# Altium project Power_Monitor.PrjPcb
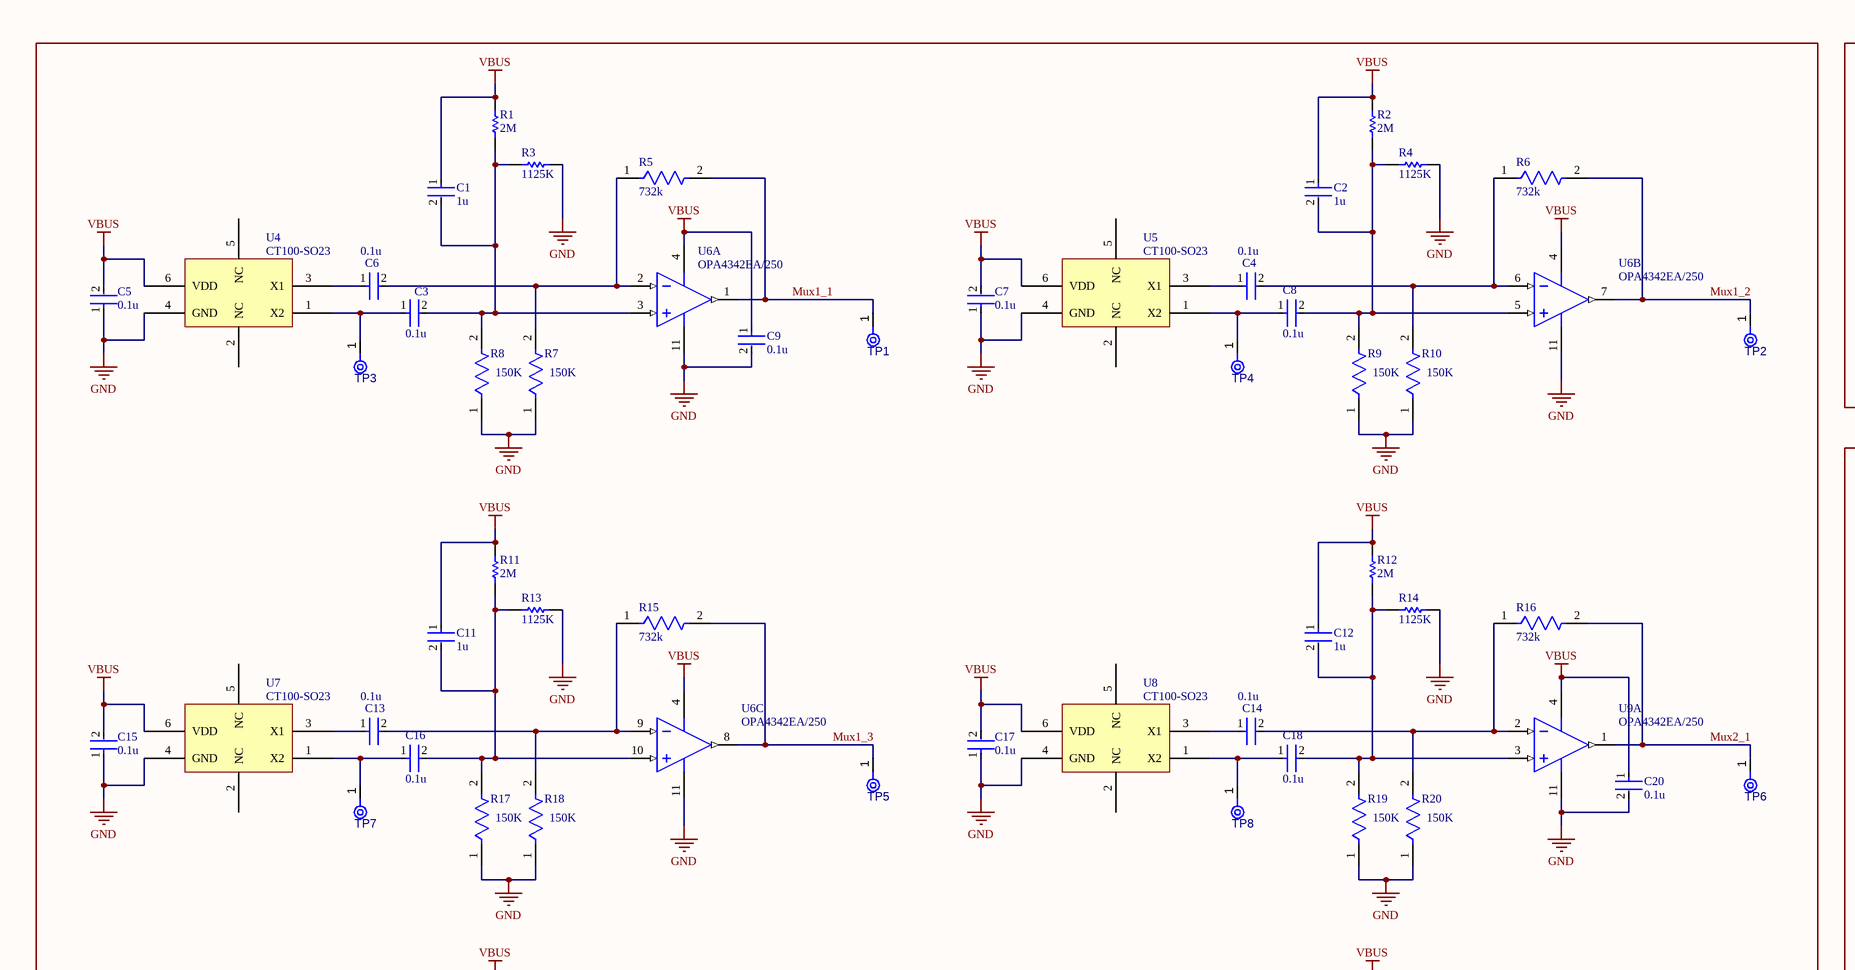
[diagram p0: 3PhaseMeter.SchDoc, top left]
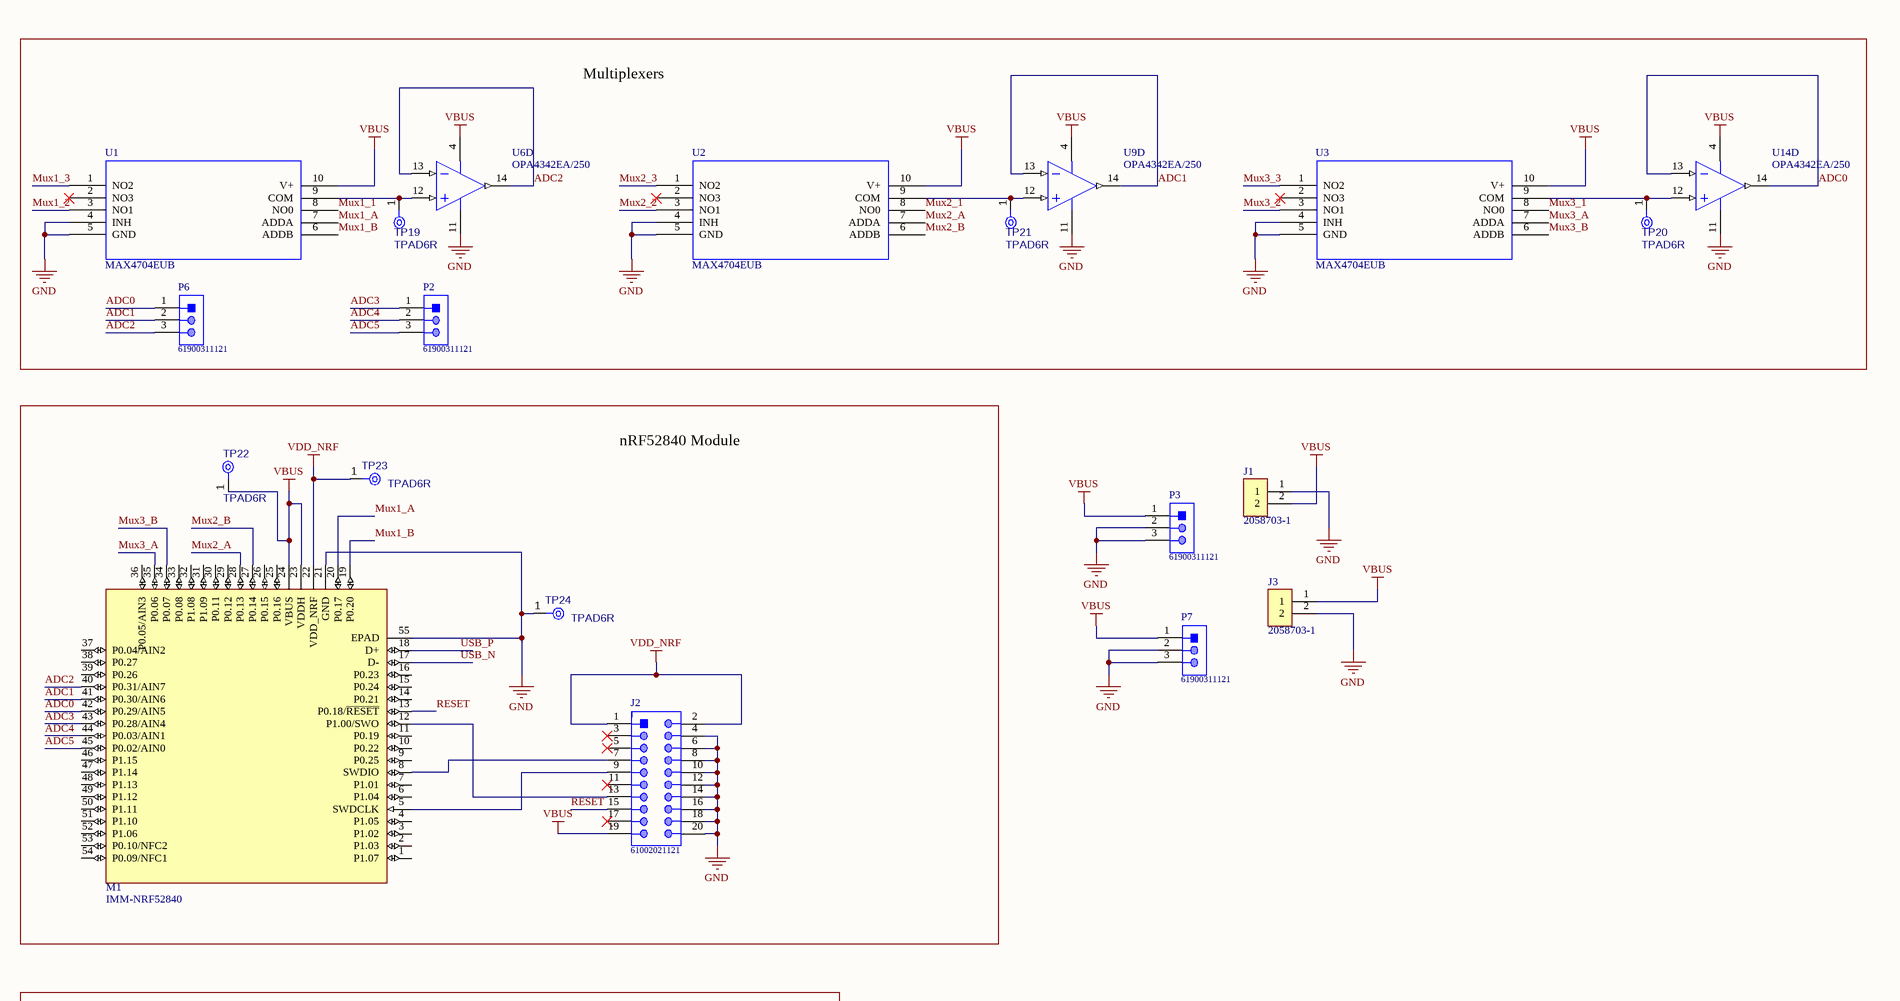
[diagram p1: 3PhaseMeter.SchDoc, top right]
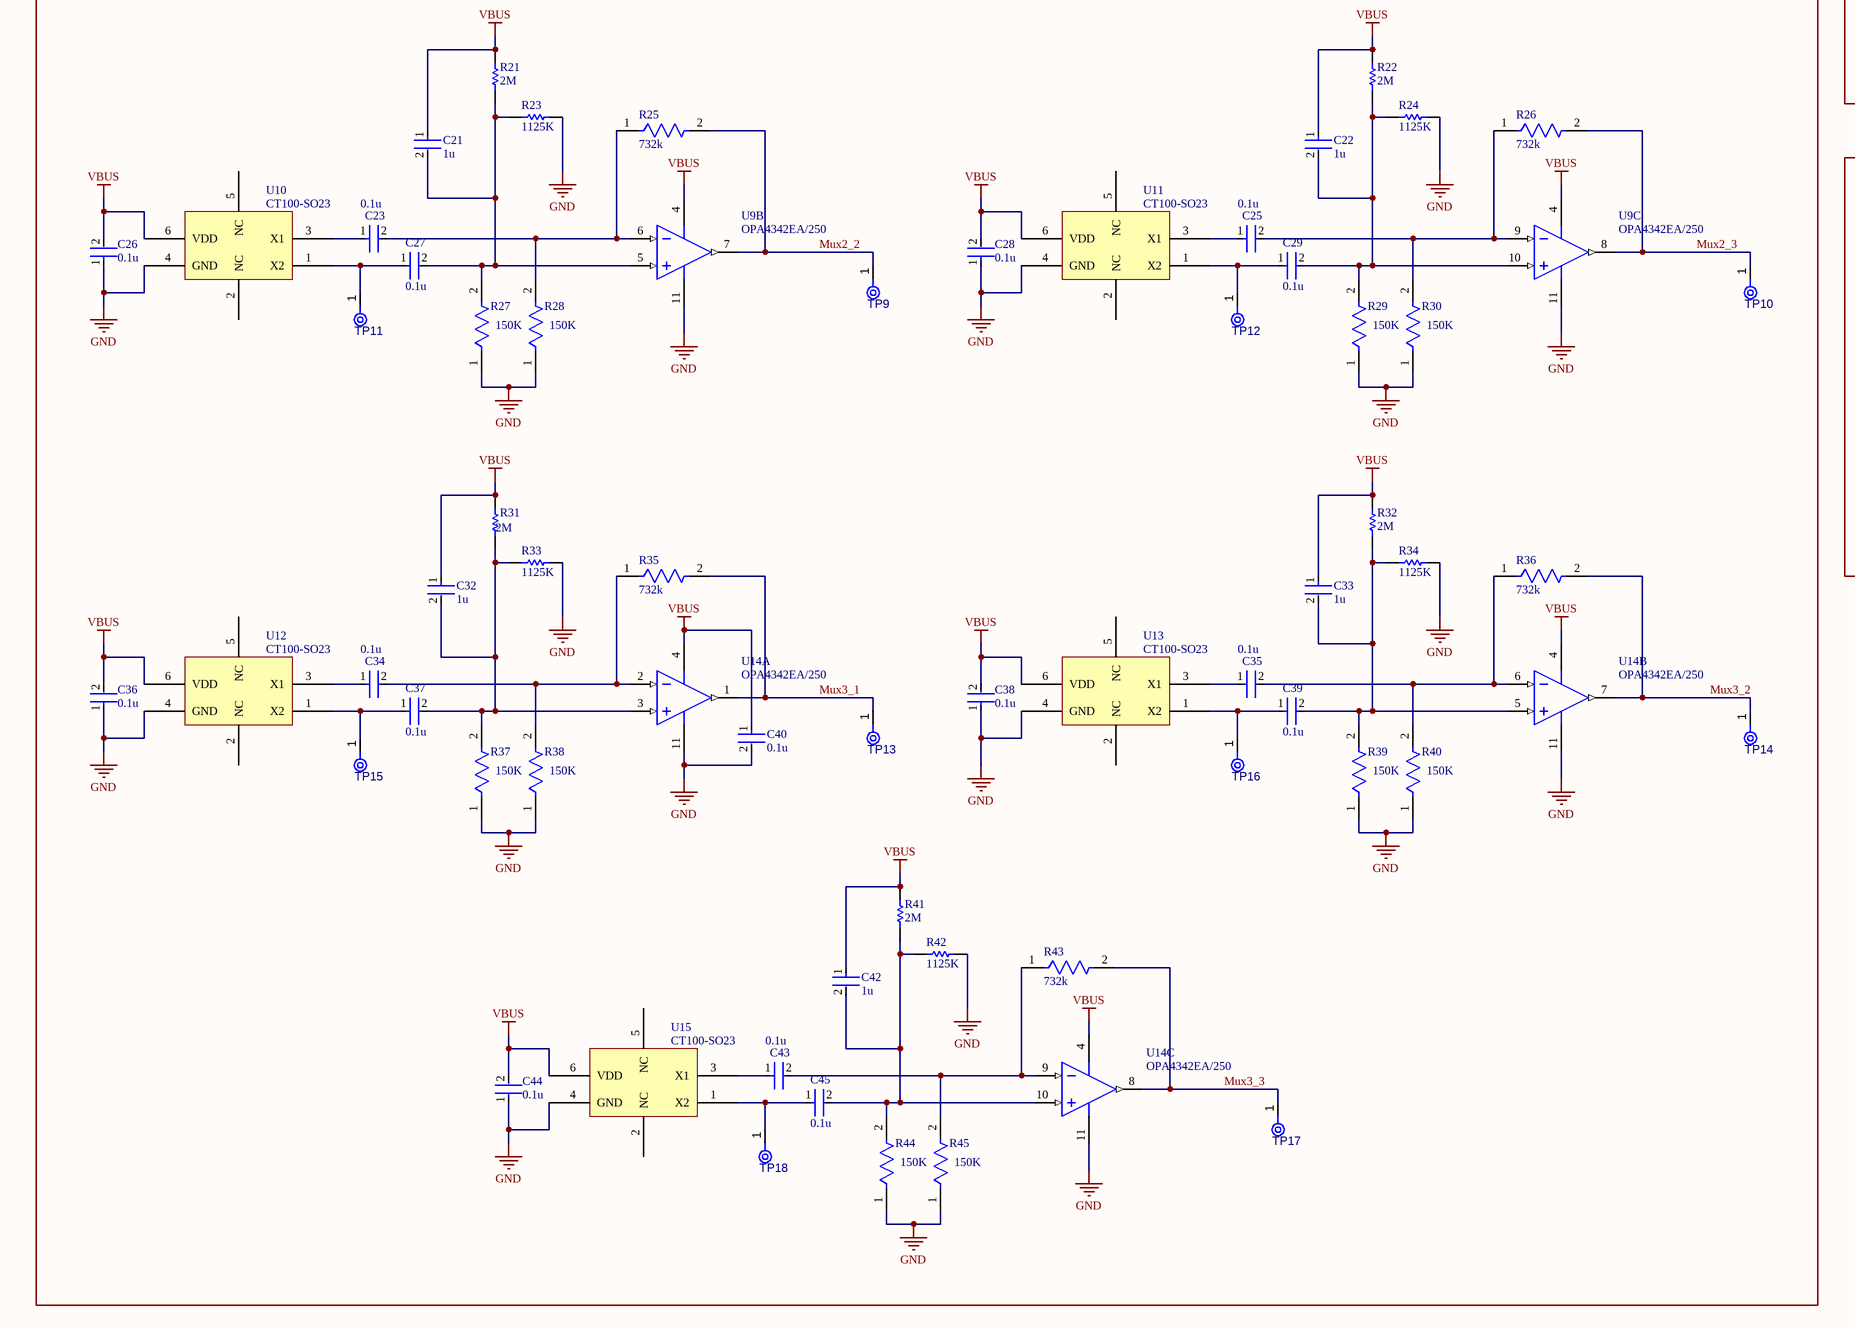
[diagram p2: 3PhaseMeter.SchDoc, bottom left]
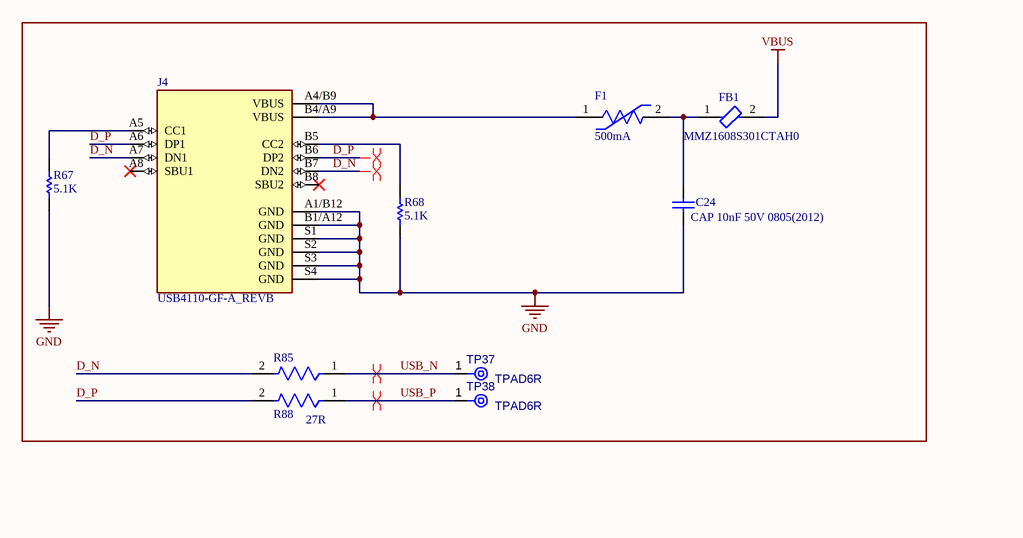
[diagram p3: 3PhaseMeter.SchDoc, bottom right]
1 sheet, 141 parts. Net scope: global (net labels, ports and power ports of the same name join across sheets).
Board file: 3PhaseMeter.PcbDoc

## Sheet 3PhaseMeter.SchDoc
size A1; SheetNumber: 1; SheetTotal: 1

### Parts
C1  1u  [FP-C3216-160-0_2-IPC_C]
C2  1u  [FP-C3216-160-0_2-IPC_C]
C3  0.1u  [FP-C0805C-DN-MFG]
C4  0.1u  [FP-C0805C-DN-MFG]
C5  0.1u  [FP-C0805C-DN-MFG]
C6  0.1u  [FP-C0805C-DN-MFG]
C7  0.1u  [FP-C0805C-DN-MFG]
C8  0.1u  [FP-C0805C-DN-MFG]
C9  0.1u  [FP-1206-L_3_2_0_2-W_1_6_0-IPC_A]
C11  1u  [FP-C3216-160-0_2-IPC_C]
C12  1u  [FP-C3216-160-0_2-IPC_C]
C13  0.1u  [FP-C0805C-DN-MFG]
C14  0.1u  [FP-C0805C-DN-MFG]
C15  0.1u  [FP-C0805C-DN-MFG]
C16  0.1u  [FP-C0805C-DN-MFG]
C17  0.1u  [FP-C0805C-DN-MFG]
C18  0.1u  [FP-C0805C-DN-MFG]
C20  0.1u  [FP-1206-L_3_2_0_2-W_1_6_0-IPC_A]
C21  1u  [FP-C3216-160-0_2-IPC_C]
C22  1u  [FP-C3216-160-0_2-IPC_C]
C23  0.1u  [FP-C0805C-DN-MFG]
C24  CAP 10nF 50V 0805(2012)  [CAPC0805(2012)75_N]
C25  0.1u  [FP-C0805C-DN-MFG]
C26  0.1u  [FP-C0805C-DN-MFG]
C27  0.1u  [FP-C0805C-DN-MFG]
C28  0.1u  [FP-C0805C-DN-MFG]
C29  0.1u  [FP-C0805C-DN-MFG]
C32  1u  [FP-C3216-160-0_2-IPC_C]
C33  1u  [FP-C3216-160-0_2-IPC_C]
C34  0.1u  [FP-C0805C-DN-MFG]
C35  0.1u  [FP-C0805C-DN-MFG]
C36  0.1u  [FP-C0805C-DN-MFG]
C37  0.1u  [FP-C0805C-DN-MFG]
C38  0.1u  [FP-C0805C-DN-MFG]
C39  0.1u  [FP-C0805C-DN-MFG]
C40  0.1u  [FP-1206-L_3_2_0_2-W_1_6_0-IPC_A]
C42  1u  [FP-C3216-160-0_2-IPC_C]
C43  0.1u  [FP-C0805C-DN-MFG]
C44  0.1u  [FP-C0805C-DN-MFG]
C45  0.1u  [FP-C0805C-DN-MFG]
F1  500mA  [FP-1206L050YR-MFG]
FB1  MMZ1608S301CTAH0  [FP-MMZ1608-0_6-IPC_C]
J1  2058703-1  [TE_2058703-1]
J2  61002021121  [61002021121]
J3  2058703-1  [TE_2058703-1]
J4  USB4110-GF-A_REVB  [GCT_USB4110-GF-A_REVB]
M1  IMM-NRF52840  [IMM-NRF52840]
P2  61900311121  [61900311121]
P3  61900311121  [61900311121]
P6  61900311121  [61900311121]
P7  61900311121  [61900311121]
R1  2M  [RESC2013X60X40LL20T25]
R2  2M  [RESC2013X60X40LL20T25]
R3  1125K  [RESC2013X60X35ML10T20]
R4  1125K  [RESC2013X60X35ML10T20]
R5  732k  [FP-AC0805-MFG]
R6  732k  [FP-AC0805-MFG]
R7  150K  [FP-CRCW0805-e3-MFG]
R8  150K  [FP-CRCW0805-e3-MFG]
R9  150K  [FP-CRCW0805-e3-MFG]
R10  150K  [FP-CRCW0805-e3-MFG]
R11  2M  [RESC2013X60X40LL20T25]
R12  2M  [RESC2013X60X40LL20T25]
R13  1125K  [RESC2013X60X35ML10T20]
R14  1125K  [RESC2013X60X35ML10T20]
R15  732k  [FP-AC0805-MFG]
R16  732k  [FP-AC0805-MFG]
R17  150K  [FP-CRCW0805-e3-MFG]
R18  150K  [FP-CRCW0805-e3-MFG]
R19  150K  [FP-CRCW0805-e3-MFG]
R20  150K  [FP-CRCW0805-e3-MFG]
R21  2M  [RESC2013X60X40LL20T25]
R22  2M  [RESC2013X60X40LL20T25]
R23  1125K  [RESC2013X60X35ML10T20]
R24  1125K  [RESC2013X60X35ML10T20]
R25  732k  [FP-AC0805-MFG]
R26  732k  [FP-AC0805-MFG]
R27  150K  [FP-CRCW0805-e3-MFG]
R28  150K  [FP-CRCW0805-e3-MFG]
R29  150K  [FP-CRCW0805-e3-MFG]
R30  150K  [FP-CRCW0805-e3-MFG]
R31  2M  [RESC2013X60X40LL20T25]
R32  2M  [RESC2013X60X40LL20T25]
R33  1125K  [RESC2013X60X35ML10T20]
R34  1125K  [RESC2013X60X35ML10T20]
R35  732k  [FP-AC0805-MFG]
R36  732k  [FP-AC0805-MFG]
R37  150K  [FP-CRCW0805-e3-MFG]
R38  150K  [FP-CRCW0805-e3-MFG]
R39  150K  [FP-CRCW0805-e3-MFG]
R40  150K  [FP-CRCW0805-e3-MFG]
R41  2M  [RESC2013X60X40LL20T25]
R42  1125K  [RESC2013X60X35ML10T20]
R43  732k  [FP-AC0805-MFG]
R44  150K  [FP-CRCW0805-e3-MFG]
R45  150K  [FP-CRCW0805-e3-MFG]
R67  5.1K  [RESC2013X70X40LL20T20]
R68  5.1K  [RESC2013X70X40LL20T20]
R85  27R  [FP-CRCW0805-e3-IPC_B]
R88  CRCW080527R0FKEA  [FP-CRCW0805-e3-IPC_B]  (value not drawn)
TP1  TPAD6R  [TP06R]  (value not drawn)  (no BOM)
TP2  TPAD6R  [TP06R]  (value not drawn)  (no BOM)
TP3  TPAD6R  [TP06R]  (value not drawn)  (no BOM)
TP4  TPAD6R  [TP06R]  (value not drawn)  (no BOM)
TP5  TPAD6R  [TP06R]  (value not drawn)  (no BOM)
TP6  TPAD6R  [TP06R]  (value not drawn)  (no BOM)
TP7  TPAD6R  [TP06R]  (value not drawn)  (no BOM)
TP8  TPAD6R  [TP06R]  (value not drawn)  (no BOM)
TP9  TPAD6R  [TP06R]  (value not drawn)  (no BOM)
TP10  TPAD6R  [TP06R]  (value not drawn)  (no BOM)
TP11  TPAD6R  [TP06R]  (value not drawn)  (no BOM)
TP12  TPAD6R  [TP06R]  (value not drawn)  (no BOM)
TP13  TPAD6R  [TP06R]  (value not drawn)  (no BOM)
TP14  TPAD6R  [TP06R]  (value not drawn)  (no BOM)
TP15  TPAD6R  [TP06R]  (value not drawn)  (no BOM)
TP16  TPAD6R  [TP06R]  (value not drawn)  (no BOM)
TP17  TPAD6R  [TP06R]  (value not drawn)  (no BOM)
TP18  TPAD6R  [TP06R]  (value not drawn)  (no BOM)
TP19  TPAD6R  [TP06R]  (no BOM)
TP20  TPAD6R  [TP06R]  (no BOM)
TP21  TPAD6R  [TP06R]  (no BOM)
TP22  TPAD6R  [TP06R]  (no BOM)
TP23  TPAD6R  [TP06R]  (no BOM)
TP24  TPAD6R  [TP06R]  (no BOM)
TP37  TPAD6R  [TP06R]  (no BOM)
TP38  TPAD6R  [TP06R]  (no BOM)
U1  MAX4704EUB  [21-0061L]
U2  MAX4704EUB  [21-0061L]
U3  MAX4704EUB  [21-0061L]
U4  CT100-SO23  [SOT95P280X135-6N]
U5  CT100-SO23  [SOT95P280X135-6N]
U6  OPA4342EA/250  [PW0014A_M]  (parts A,B,C,D of 4)
U7  CT100-SO23  [SOT95P280X135-6N]
U8  CT100-SO23  [SOT95P280X135-6N]
U9  OPA4342EA/250  [PW0014A_M]  (parts A,B,C,D of 4)
U10  CT100-SO23  [SOT95P280X135-6N]
U11  CT100-SO23  [SOT95P280X135-6N]
U12  CT100-SO23  [SOT95P280X135-6N]
U13  CT100-SO23  [SOT95P280X135-6N]
U14  OPA4342EA/250  [PW0014A_M]  (parts A,B,C,D of 4)
U15  CT100-SO23  [SOT95P280X135-6N]

### Nets
GND: C5.1 C7.1 C9.2 C15.1 C17.1 C20.2 C24.1 C26.1 C28.1 C36.1 C38.1 C40.2 C44.1 J1.1 J2.4 J2.6 J2.8 J2.10 J2.12 J2.14 J2.16 J2.18 J2.20 J3.2 J4.A1/B12(GND) J4.B1/A12(GND) J4.S1(GND) J4.S2(GND) J4.S3(GND) J4.S4(GND) M1.21(GND) M1.55(EPAD) P3.2 P3.3 P7.2 P7.3 R3.2 R4.2 R7.1 R8.1 R9.1 R10.1 R13.2 R14.2 R17.1 R18.1 R19.1 R20.1 R23.2 R24.2 R27.1 R28.1 R29.1 R30.1 R33.2 R34.2 R37.1 R38.1 R39.1 R40.1 R42.2 R44.1 R45.1 R67.1 R68.1 TP24.1(TP) U1.4(INH) U1.5(GND) U2.4(INH) U2.5(GND) U3.4(INH) U3.5(GND) U4.4(GND) U5.4(GND) U6.11(V-) U7.4(GND) U8.4(GND) U9.11(V-) U10.4(GND) U11.4(GND) U12.4(GND) U13.4(GND) U14.11(V-) U15.4(GND)
VBUS: C1.1 C2.1 C5.2 C7.2 C9.1 C11.1 C12.1 C15.2 C17.2 C20.1 C21.1 C22.1 C26.2 C28.2 C32.1 C33.1 C36.2 C38.2 C40.1 C42.1 C44.2 FB1.2 J1.2 J2.19 J3.1 M1.23(VDDH) M1.24(VBUS) P3.1 P7.1 R1.2 R2.2 R11.2 R12.2 R21.2 R22.2 R31.2 R32.2 R41.2 TP22.1(TP) U1.10(V+) U2.10(V+) U3.10(V+) U4.6(VDD) U5.6(VDD) U6.4(V+) U7.6(VDD) U8.6(VDD) U9.4(V+) U10.6(VDD) U11.6(VDD) U12.6(VDD) U13.6(VDD) U14.4(V+) U15.6(VDD)
VDD_NRF: J2.1 J2.2 M1.22(VDD_NRF) TP23.1(TP)
ADC0: M1.42(P0.29/AIN5) P6.1 U14.13(IN_D-) U14.14(OUT_D)
ADC1: M1.41(P0.30/AIN6) P6.2 U9.13(IN_D-) U9.14(OUT_D)
ADC2: M1.40(P0.31/AIN7) P6.3 U6.13(IN_D-) U6.14(OUT_D)
ADC3: M1.43(P0.28/AIN4) P2.1
ADC4: M1.44(P0.03/AIN1) P2.2
ADC5: M1.45(P0.02/AIN0) P2.3
D_N: J4.A7(DN1) J4.B7(DN2) R85.2
D_P: J4.A6(DP1) J4.B6(DP2) R88.2
Mux1_1: R5.2 TP1.1(TP) U1.8(NO0) U6.1(OUT_A)
Mux1_2: R6.2 TP2.1(TP) U1.3(NO1) U6.7(OUT_B)
Mux1_3: R15.2 TP5.1(TP) U1.1(NO2) U6.8(OUT_C)
Mux1_A: M1.20(P0.17) U1.7(ADDA)
Mux1_B: M1.19(P0.20) U1.6(ADDB)
Mux2_1: R16.2 TP6.1(TP) U2.8(NO0) U9.1(OUT_A)
Mux2_2: R25.2 TP9.1(TP) U2.3(NO1) U9.7(OUT_B)
Mux2_3: R26.2 TP10.1(TP) U2.1(NO2) U9.8(OUT_C)
Mux2_A: M1.28(P0.13) U2.7(ADDA)
Mux2_B: M1.27(P0.14) U2.6(ADDB)
Mux3_1: R35.2 TP13.1(TP) U3.8(NO0) U14.1(OUT_A)
Mux3_2: R36.2 TP14.1(TP) U3.3(NO1) U14.7(OUT_B)
Mux3_3: R43.2 TP17.1(TP) U3.1(NO2) U14.8(OUT_C)
Mux3_A: M1.35(P0.06) U3.7(ADDA)
Mux3_B: M1.34(P0.07) U3.6(ADDB)
RESET: J2.15 M1.13(P0.18/~{RESET})
USB_N: M1.17(D-) R85.1 TP37.1(TP)
USB_P: M1.18(D+) R88.1 TP38.1(TP)
NetC1_2: C1.2 C3.2 R1.1 R3.1 R8.2 U6.3(IN_A+)
NetC2_2: C2.2 C8.2 R2.1 R4.1 R9.2 U6.5(IN_B+)
NetC3_1: C3.1 TP3.1(TP) U4.1(X2)
NetC4_1: C4.1 U5.3(X1)
NetC4_2: C4.2 R6.1 R10.2 U6.6(IN_B-)
NetC6_1: C6.1 U4.3(X1)
NetC6_2: C6.2 R5.1 R7.2 U6.2(IN_A-)
NetC8_1: C8.1 TP4.1(TP) U5.1(X2)
NetC11_2: C11.2 C16.2 R11.1 R13.1 R17.2 U6.10(IN_C+)
NetC12_2: C12.2 C18.2 R12.1 R14.1 R19.2 U9.3(IN_A+)
NetC13_1: C13.1 U7.3(X1)
NetC13_2: C13.2 R15.1 R18.2 U6.9(IN_C-)
NetC14_1: C14.1 U8.3(X1)
NetC14_2: C14.2 R16.1 R20.2 U9.2(IN_A-)
NetC16_1: C16.1 TP7.1(TP) U7.1(X2)
NetC18_1: C18.1 TP8.1(TP) U8.1(X2)
NetC21_2: C21.2 C27.2 R21.1 R23.1 R27.2 U9.5(IN_B+)
NetC22_2: C22.2 C29.2 R22.1 R24.1 R29.2 U9.10(IN_C+)
NetC23_1: C23.1 U10.3(X1)
NetC23_2: C23.2 R25.1 R28.2 U9.6(IN_B-)
NetC24_2: C24.2 F1.2 FB1.1
NetC25_1: C25.1 U11.3(X1)
NetC25_2: C25.2 R26.1 R30.2 U9.9(IN_C-)
NetC27_1: C27.1 TP11.1(TP) U10.1(X2)
NetC29_1: C29.1 TP12.1(TP) U11.1(X2)
NetC32_2: C32.2 C37.2 R31.1 R33.1 R37.2 U14.3(IN_A+)
NetC33_2: C33.2 C39.2 R32.1 R34.1 R39.2 U14.5(IN_B+)
NetC34_1: C34.1 U12.3(X1)
NetC34_2: C34.2 R35.1 R38.2 U14.2(IN_A-)
NetC35_1: C35.1 U13.3(X1)
NetC35_2: C35.2 R36.1 R40.2 U14.6(IN_B-)
NetC37_1: C37.1 TP15.1(TP) U12.1(X2)
NetC39_1: C39.1 TP16.1(TP) U13.1(X2)
NetC42_2: C42.2 C45.2 R41.1 R42.1 R44.2 U14.10(IN_C+)
NetC43_1: C43.1 U15.3(X1)
NetC43_2: C43.2 R43.1 R45.2 U14.9(IN_C-)
NetC45_1: C45.1 TP18.1(TP) U15.1(X2)
NetF1_1: F1.1 J4.A4/B9(VBUS) J4.B4/A9(VBUS)
NetJ2_7: J2.7 M1.8(SWDIO)
NetJ2_9: J2.9 M1.5(SWDCLK)
NetJ2_13: J2.13 M1.12(P1.00/SWO)
NetJ4_A5: J4.A5(CC1) R67.2
NetJ4_B5: J4.B5(CC2) R68.2
NetTP19_1: TP19.1(TP) U1.9(COM) U6.12(IN_D+)
NetTP20_1: TP20.1(TP) U3.9(COM) U14.12(IN_D+)
NetTP21_1: TP21.1(TP) U2.9(COM) U9.12(IN_D+)

Not connected (* = marked no-connect by the designer): J2 3* 5* 11* 17*; J4 A8(SBU1)* B8(SBU2)*; M1 1(P1.07) 2(P1.03) 3(P1.02) 4(P1.05) 6(P1.04) 7(P1.01) 9(P0.25) 10(P0.22) 11(P0.19) 14(P0.21) 15(P0.24) 16(P0.23) 25(P0.16) 26(P0.15) 29(P0.12) 30(P0.11) 31(P1.09) 32(P1.08) 33(P0.08) 36(P0.05/AIN3) 37(P0.04/AIN2) 38(P0.27) 39(P0.26) 46(P1.15) 47(P1.14) 48(P1.13) 49(P1.12) 50(P1.11) 51(P1.10) 52(P1.06) 53(P0.10/NFC2) 54(P0.09/NFC1); U1 2(NO3)*; U2 2(NO3)*; U3 2(NO3)*; U4 2(NC) 5(NC); U5 2(NC) 5(NC); U7 2(NC) 5(NC); U8 2(NC) 5(NC); U10 2(NC) 5(NC); U11 2(NC) 5(NC); U12 2(NC) 5(NC); U13 2(NC) 5(NC); U15 2(NC) 5(NC)

### Layout directives
differential pair: D_N, D_P, USB_N, USB_P

### Notes on the sheet
- Multiplexers
- nRF52840 Module

### Library data of the parts
C1 C2 C11 C12 C21 C22 C32 C33 C42 = CMP-08246-006474-1: Multilayer Ceramic Capacitors 1uF ±10% 50V X8R SMD 1206; Max Operating Temperature: 150°C; Length: 3.2mm; Case Code (Metric): 3216; Packaging: Tape and Reel; Voltage Rating: 50V; RoHS Compliant: Yes; Package Quantity: 2000; Case/Package: 1206; Series: C; Resistor Type: Ceramic; Mount: Surface Mount; Weight: 0.000571oz; Tolerance: 10%; Width: 1.6mm; Case Code (Imperial): 1206; REACH SVHC: No SVHC; Voltage Rating (DC): 50V; Dielectric: X8R; Height: 1.6mm; Thickness: 0.071inch; Termination: SMD/SMT; Lead Free: Lead Free; Min Operating Temperature: -55°C; Capacitance: 1uF; Depth: 1.6mm; Features: High Temperature
C3-C8 C13-C18 C23 C25-C29 C34-C39 C43-C45 = CMP-2007-00279-2: CAP CER 0.1UF 50V X7R 0805; Manufacturer Part Number: C0805C104K5RACTU; Manufacturer: KEMET; Value: 0.10 μF; Tolerance: 0.1; Temperature Coefficient: 30ppm/°C; Material: Ceramic; Device Class L2: Capacitors; Temperature Range Low: -55°C; Voltage Rating: 50 V; Digikey Description: CAP CER 0.1UF 50V X7R 0805; Category: Cap; ComponentLink2Description: Datasheet; Octopart: https://octopart.com/c0805c104k5ractu-kemet-143926; RoHS: TRUE; ComponentLink2URL: https://content.kemet.com/datasheets/KEM_C1003_C0G_SMD.pdf; Temperature Characteristic: X7R; Temperature: -55°C to +125°C; Height: 0.88mm; Temperature Range High: +125°C; Device Class L1: Passive Components; Automotive: No; Lead Free: Yes; Ipc Land Pattern Name: CAPC200125X78; Device Class L3: Ceramic Capacitors; Mouser Description: Cap Ceramic 0.1uF 50V X7R 10% SMD 2.0 x 1.2 mm 125 C Paper T/R; Capacitance: 0.10 μF; Package: C0805C-DN
C9 C20 C40 = CMP-04427-019132-1: General Purpose Ceramic Capacitor, 1206, 100nF, 5%, X7R, 15%, 50V; Insulation Resistance: 100GR; Dissipation Factor: 2.5%; Depth: 1.6mm; Case/Package: 1206; REACH SVHC: No SVHC; Capacitance: 100nF; Height: 0.5mm; Termination: SMD/SMT; Packaging: Cut Tape; Voltage: 50V; Min Operating Temperature: -55°C; Width: 1.6mm; Dielectric: X7R; Series: X7R; Case Code (Metric): 3216; Contact Plating: Tin; Package Quantity: 4000; Lead Free: Lead Free; Thickness: 0.037inch; Voltage Rating (DC): 50V; RoHS Compliant: Yes; Voltage Rating: 50V; Length: 3.2mm; Tolerance: 5%; Mount: Surface Mount; Radiation Hardening: No; Weight: 0.000571oz; Max Operating Temperature: 125°C; Dielectric Material: Ceramic; Case Code (Imperial): 1206
C24 = CMP-1036-03839-1: CAP 10nF 50V ±5% 0805 (2012 Metric) Thickness 0.75mm SMD; Case-Metric: 2012; Case-EIA: 0805; Tolerance: Â±5%; Technology: SMT; Max Thickness: 0.75 mm; Rated Voltage: 50 V; Value: 10nF
F1 = CMP-08606-000073-1: PTC RESET FUSE 6V 500MA 1206; Trip Current: 1A; Current Rating: 100A; Resistance: 700mR; Approvals: cULus; Max Power Dissipation: 600mW; Time to Trip: 0.1s; Hold Current: 500mA; Min Operating Temperature: -40°C; Voltage Rating (DC): 6V; Working Voltage: 6V; Package Quantity: 4000; Termination: SMD/SMT; Lead Free: Lead Free; REACH SVHC: No SVHC; Series: 1206L; Max Voltage Rating (DC): 6V; Height: 0.75mm; Terminal Material: Copper; Packaging: Tape and Reel; Case Code (Imperial): 1206; Length: 3.4mm; RoHS Compliant: Yes; Operating Supply Voltage: 6V; Case Code (Metric): 3216; Width: 1.8mm; Max Current Rating: 100A; Case/Package: 1206; Power Dissipation: 600mW; Max Operating Temperature: 85°C; Voltage Rating: 6V
FB1 = CMP-08257-000259-1: Signal Line Ferrite Bead 300 Ω 100MHz 500mA DCR 250mΩ SMD 0603; Tolerance: 25%; Impedance: 300R; Number of Lines: 1; DC Resistance (DCR): 250mR; Length: 0.063inch; Max DC Current: 500mA; Case Code (Imperial): 0603; Termination: SMD/SMT; Weight: 7.1E-05oz; RoHS Compliant: No; Mount: Surface Mount; Height: 0.037inch; Max Current Rating: 500mA; Max Operating Temperature: 125°C; Width: 0.031inch; Packaging: Tape and Reel; Test Frequency: 100MHz; Case Code (Metric): 1608; Case/Package: 0603; Min Operating Temperature: -55°C; Package Quantity: 4000
J1 J3 = 2058703-1: CONN SSL RCPT & BLADE 2POS 4MM; MF: {'manufacturer': u'TE Connectivity'}; MP: 2058703-1; Value: *; Package: None; Price: None; Availability: Unavailable
J2 = CMP-1502-01036-1: SMT Vertical Pin Header WR-PHD, Pitch 2.54 mm, Dual Row, 20 pins; Manufacturer: Wurth Elektronik; Pin Number: 20; Gender: Male; Rated Current: 3A; Working Voltage: 250VAC; Pitch: 2.54mm; Contact Resistance: 20mOhm; Withstanding Voltage: 500VAC; Package Reference: 61002021121; Part Number: 61002021121; Datasheet URL: https://katalog.we-online.de/em/datasheet/6100xx21121.pdf; Mounting Technology: SMT; Orientation: Vertical; Row Number: Dual; Publisher: WurthElektronik; Packaging: Tube; Manufacturer URL: http://www.we-online.de; Operating Temperature: -40to125degC
J4 = USB4110-GF-A_REVB: MF: {'manufacturer': u'GCT'}; MP: USB4110-GF-A_REVB; Package: None; Price: None; Availability: Unavailable; Value: *
M1 = IMM-NRF52840: IMM-NRF52840 - ANT+ & BLE module
P2 P3 P6 P7 = CMP-1502-00585-1: Male Locking Header WR-WTB, THT, Vertical, pitch 2.54 mm, 1 x 3 position; Manufacturer: Wurth Elektronik; Contact Resistance: 20mOhm; Pitch: 2.54mm; Working Voltage: 250VAC; Position: 1x3; Mounting Technology: THT; Operating Temperature: -40to105degC; Part Number: 61900311121; Datasheet URL: https://katalog.we-online.de/em/datasheet/6190xx11121.pdf; Manufacturer URL: http://www.we-online.de; Publisher: WurthElektronik; Orientation: Vertical; Gender: Male; Package Reference: 61900311121; Packaging: Bag
R1 R2 R11 R12 R21 R22 R31 R32 R41 = CMP-2001-00611-1: Part Number: ERA6AEB204V; Manufacturer: Panasonic
R3 R4 R13 R14 R23 R24 R33 R34 R42 = CMP-2100-03668-1: Chip Resistor, 100 KOhm, +/- 1%, 0.125 W, -55 to 155 degC, 0805 (2012 Metric), RoHS, Tape and Reel; Manufacturer: Yageo; Max Power Dissipation: 125mW; Voltage Rating: 150V; Temperature Coefficient: 100ppm/degreesC; Manufacturer URL: http://www.yageo.com/; Min Operating Temperature: -55degC; Lead Pitch: 0.4mm; Composition: ThickFilm; Case Code (Metric): 2012; Military Standard: Not; Package Description: 2-Pin Surface Mounted Device, Body 2 x 1.25 mm; REACH SVHC: Unknown; RoHSCompliant: true; Depth: 1.25mm; Number of Pins: 2; Lead Free: LeadFree; Resistance: 100KOhm; Datasheet URL: http://www.yageo.com/NewPortal/yageodocoutput?fileName=/pdf/R-Chip/PYu-RC_Group_51_RoHS_L_5.pdf; Max Operating Temperature: 155degC; Case/Package: 0805; Package Quantity: 1; Case Code (Imperial): 0805; Power Rating: 125mW; Width: 0.049inch; Package Reference: 0805; Height: 0.024inch; Termination: SMD/SMT; Tolerance: 1%; Datasheet Version: Rev. 5, 10/2016; Length: 2mm; Voltage Rating (DC): 150V; Number of Terminations: 2; Packaging: TapeandReel
R5 R6 R15 R16 R25 R26 R35 R36 R43 = CMP-2001-04479-2: Res Thick Film 0805 100K Ohm 1% 1/8W ±100ppm/°C Molded SMD SMD Paper T/R; Manufacturer: Yageo; Manufacturer Part Number: AC0805FR-07100KL; Voltage Rating: 150V; Value: 100KΩ; Tolerance: 0.01; Automotive Grade: Grade 0; Composition: Thick Film; Octopart: https://octopart.com/ac0805fr-07100kl-yageo-24517275; Series: AC; Device Class L1: Passive Components; Height: 0.6mm; Package: AC0805; Digikey Description: Res Thick Film 0805 100K Ohm 1% 1/8W ±100ppm/°C Molded SMD SMD Paper T/R; Power Rating: 1/8W; Temperature: -55°C to +155°C; Temperature Range High: +155°C; RoHS: TRUE; Mouser Description: Thick Film Resistors 1/8W 100K ohm 1% AEC-Q200; Temperature Range Low: -55°C; Resistance: 100KΩ; Footprint Url: http://www.yageo.com/exep/pages/download/literatures/PYu-R_Mount_10.pdf; Ipc Land Pattern Name: RESC200125X50; ComponentLink2Description: Datasheet; Automotive: Yes; Category: Res; Device Class L3: Chip SMD Resistors; Lead Free: Yes; ComponentLink2URL: http://www.yageo.com/documents/recent/PYu-AC_51_RoHS_L_6.pdf; Device Class L2: Resistors
R7-R10 R17-R20 R27-R30 R37-R40 R44 R45 = CMP-2001-04960-2: RES Thick Film, 150kΩ, 1%, 0.125W, 100ppm/°C, 0805; Power Rating: 125mW; Resistance: 150kR; Voltage Rating: 150V; Length: 2mm; Height: 0.45mm; Radiation Hardening: No; Package Quantity: 5000; Packaging: Tape and Reel; Depth: 1.25mm; Case Code (Metric): 2012; Military Standard: Not; Composition: Thick Film; Contact Plating: Tin; Min Operating Temperature: -55°C; Tolerance: 1%; Lead Free: Lead Free; Weight: 0.000194oz; Case/Package: 0805; Max Operating Temperature: 155°C; Case Code (Imperial): 0805; Temperature Coefficient: 100ppm/°C; Voltage Rating (DC): 150V; Width: 1.25mm; Termination: SMD/SMT
R67 R68 = CMP-2001-00553-1: Part Number: ERJ6ENF5101V; Manufacturer: Panasonic
R85 = CMP-2001-03744-2: RES Thick Film, 27Ω, 1%, 0.125W, 100ppm/°C, 0805; Working Voltage: 150V; Max Power Dissipation: 125mW; Composition: Thick Film; Termination: SMD/SMT; Temperature Coefficient: 100ppm/°C; Contact Plating: Tin; Width: 0.049inch; Features: Automotive AEC-Q200; Voltage Rating: 150V; Resistance: 27R; Military Standard: Not; Case Code (Imperial): 0805; Case Code (Metric): 2012; Voltage Rating (DC): 150V; Radiation Hardening: No; Length: 2mm; Packaging: Tape and Reel; Weight: 0.000194oz; Tolerance: 1%; Number of Terminations: 2; Case/Package: 0805; Height: 0.45mm; Power Rating: 125mW; Max Operating Temperature: 155°C; Package Quantity: 10; Depth: 1.25mm; Number of Pins: 2; Min Operating Temperature: -55°C; Lead Free: Lead Free
R88 = CMP-2001-03744-2: RES Thick Film, 27Ω, 1%, 0.125W, 100ppm/°C, 0805; Working Voltage: 150V; Resistance: 27R; Max Power Dissipation: 125mW; Composition: Thick Film; Termination: SMD/SMT; Temperature Coefficient: 100ppm/°C; Contact Plating: Tin; Width: 0.049inch; Features: Automotive AEC-Q200; Voltage Rating: 150V; Military Standard: Not; Case Code (Imperial): 0805; Case Code (Metric): 2012; Voltage Rating (DC): 150V; Radiation Hardening: No; Length: 2mm; Packaging: Tape and Reel; Weight: 0.000194oz; Tolerance: 1%; Number of Terminations: 2; Case/Package: 0805; Height: 0.45mm; Power Rating: 125mW; Max Operating Temperature: 155°C; Package Quantity: 10; Depth: 1.25mm; Number of Pins: 2; Min Operating Temperature: -55°C; Lead Free: Lead Free
TP1-TP24 TP37 TP38 = CMP-00028-00002-2: 0.6mm round; Pins: 1
U1-U3 = MAX4704EUB: MF: {'manufacturer': u'Maxim Integrated'}; Price: None; Availability: Unavailable; MP: MAX4704EUB; Package: None; Value: *
U4 U5 U7 U8 U10-U13 U15 = CMP-010-00025-1: TMR Sensor
U6 U9 U14 = CMP-0272-01744-3: Low Cost, Low Power, Rail-to-Rail Operational Amplifier MicroAmplifier(TM) Series, 2.7 to 5.5 V, -55 to 125 degC, 14-pin SOP (PW14), Green (RoHS & no Sb/Br); Manufacturer: Texas Instruments; Rating: Catalog; IIB(Max)(pA): 10; Number of Channels: 4; Total Supply Voltage(Min)(+5V is 5, +/-5V is 10): 2.7; Slew Rate(Typ)(V/us): 1; Iq per channel(Max)(mA): 0.25; Sub Family: Low Input Bias Current Amp (<=10pA), Low Power Amp (<=500uA), Low Supply Voltage Amplifier (<=2.7V), Precision Amplifier; Offset Drift(Typ)(uV/C): 3; CMRR(Min)(dB): 76; Vio (25C)(Max)(mV): 6; Total Supply Voltage(Max)(+5V is 5, +/-5V is 10): 5.5; Packing: SMALL T&R; PackageReference: PW0014A; PackageVersion: 4040064-3/G, 02/2011; ComponentLink1Description: Manufacturer URL; Mounting Technology: Surface Mount; PackageDescription: 14-Pin Plastic Small Outline, Body 5 x 4.4 mm, Pitch 0.65 mm; ComponentLink2URL: http://www.ti.com/lit/ds/symlink/opa4342.pdf; ComponentLink3Description: Package Specification; Code_JEDEC: MO-153; ComponentLink3URL: http://www.ti.com/litv/pdf/mpds360; GBW(Typ)(MHz): 1; PartNumber: OPA4342EA/250; DatasheetVersion: SBOS106A; ComponentLink1URL: http://www.ti.com/; Eco-Plan: Green (RoHS & no Sb/Br); ComponentLink2Description: Datasheet